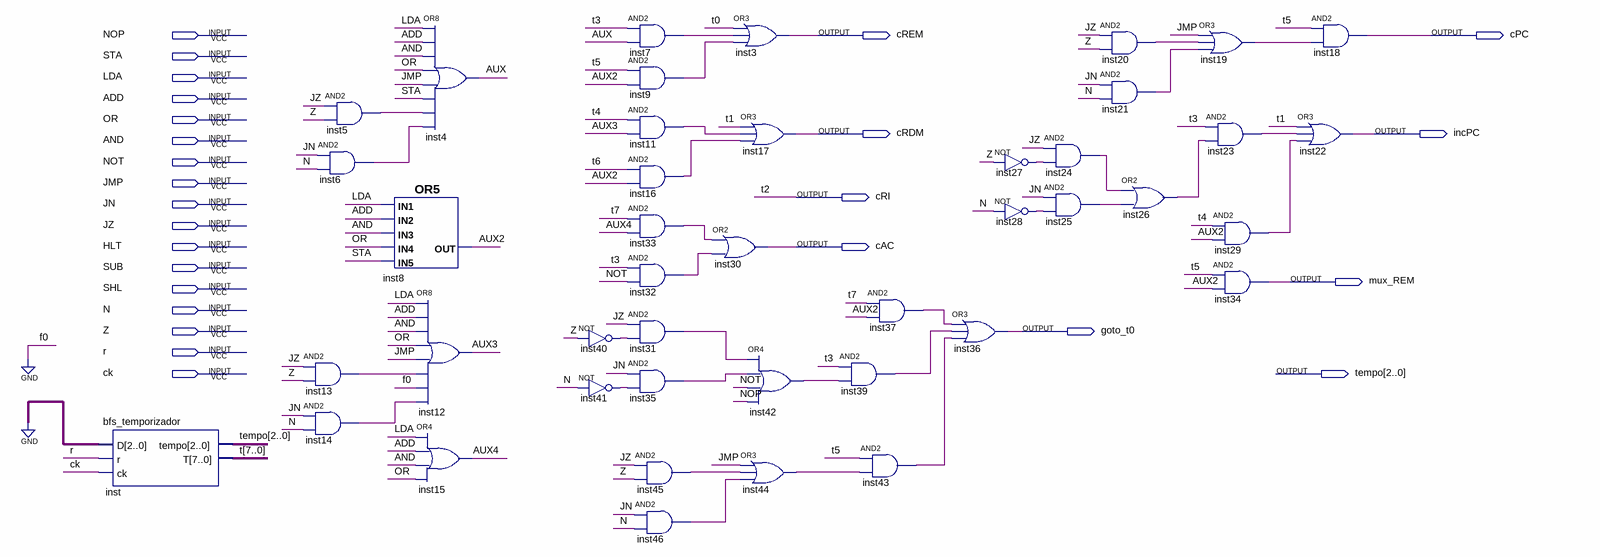
[diagram p0: schematic sheet]
// Quartus schematic bfs_controle.bdf as structural Verilog: 43 symbols, 26 pins
module bfs_controle (
  input  NOP,
  input  STA,
  input  LDA,
  input  ADD,
  input  OR,
  input  AND,
  input  NOT,
  input  JMP,
  input  JN,
  input  JZ,
  input  HLT,
  input  SUB,
  input  SHL,
  input  N,
  input  Z,
  input  r,
  input  ck,
  output cREM,
  output cPC,
  output cRDM,
  output incPC,
  output cRI,
  output cAC,
  output mux_REM,
  output goto_t0,
  output [2:0] tempo
);

  wire AUX, AUX2, AUX3, AUX4, inst5_out, inst6_out, inst7_out, inst9_out, inst11_out, inst13_out, inst14_out,
       inst16_out, inst19_out, inst20_out, inst21_out, inst23_out, inst24_out, inst25_out, inst26_out,
       inst27_out, inst28_out, inst29_out, inst31_out, inst32_out, inst33_out, inst35_out, inst37_out,
       inst39_out, inst40_out, inst41_out, inst42_out, inst43_out, inst44_out, inst45_out, inst46_out;
  wire [7:0] t;

  bfs_temporizador inst (.D(3'b000), .r(r), .ck(ck), .tempo(tempo), .T({t[7:3], cRI, t[1:0]}));
  and inst6 (inst6_out, JN, N);
  and inst13 (inst13_out, JZ, Z);
  and inst14 (inst14_out, JN, N);
  and inst5 (inst5_out, JZ, Z);
  or inst4 (AUX, LDA, ADD, AND, OR, JMP, STA, inst5_out, inst6_out);
  or inst8 (AUX2, LDA, ADD, AND, OR, STA);
  or inst12 (AUX3, LDA, ADD, AND, OR, JMP, inst13_out, 1'b0, inst14_out);
  or inst15 (AUX4, LDA, ADD, AND, OR);
  not inst40 (inst40_out, Z);
  not inst41 (inst41_out, N);
  and inst7 (inst7_out, t[3], AUX);
  and inst9 (inst9_out, t[5], AUX2);
  and inst11 (inst11_out, t[4], AUX3);
  and inst16 (inst16_out, t[6], AUX2);
  and inst33 (inst33_out, t[7], AUX4);
  and inst32 (inst32_out, t[3], NOT);
  and inst31 (inst31_out, JZ, inst40_out);
  and inst35 (inst35_out, JN, inst41_out);
  and inst45 (inst45_out, JZ, Z);
  and inst46 (inst46_out, JN, N);
  or inst30 (cAC, inst33_out, inst32_out);
  or inst3 (cREM, t[0], inst7_out, inst9_out);
  or inst17 (cRDM, t[1], inst11_out, inst16_out);
  or inst42 (inst42_out, inst31_out, inst35_out, NOT, NOP);
  or inst44 (inst44_out, JMP, inst45_out, inst46_out);
  and inst37 (inst37_out, t[7], AUX2);
  and inst39 (inst39_out, t[3], inst42_out);
  and inst43 (inst43_out, t[5], inst44_out);
  not inst27 (inst27_out, Z);
  not inst28 (inst28_out, N);
  or inst36 (goto_t0, inst37_out, inst39_out, inst43_out);
  and inst24 (inst24_out, JZ, inst27_out);
  and inst25 (inst25_out, JN, inst28_out);
  and inst20 (inst20_out, JZ, Z);
  and inst21 (inst21_out, JN, N);
  or inst26 (inst26_out, inst24_out, inst25_out);
  or inst19 (inst19_out, JMP, inst20_out, inst21_out);
  and inst23 (inst23_out, t[3], inst26_out);
  and inst29 (inst29_out, t[4], AUX2);
  and inst34 (mux_REM, t[5], AUX2);
  and inst18 (cPC, t[5], inst19_out);
  or inst22 (incPC, t[1], inst23_out, inst29_out);

  // Other names for the same wires on the sheet: t[2] = cRI; t2 = cRI
endmodule
